# Altium schematic sheet MCH_FPGA_Banks_224_225_226_227_228.SchDoc: Metlino
size 420 x 297 mm; CheckedBy: P.Kulik,T.Przywozki,W.Ruclo; Author: G.Kasprowicz; CompanyName: WUT ISE; DrawnBy: G.Kasprowicz; Organization: WUT ISE; Address1: PW ISE; Address2: Nowowiejska 15/19 00-665 Warsaw; Address3: gkasprow@gmail.com; DocumentNumber: 8; Revision: 2; SheetNumber: 8; SheetTotal: 29; ModifiedBy: -; CheckedDate: -; Title2: FPGA banks - GTH; DivGrp: WUT ISE; Designer: G.Kasprowicz; ModifiedDate: -; ProjectName: Sensor Box
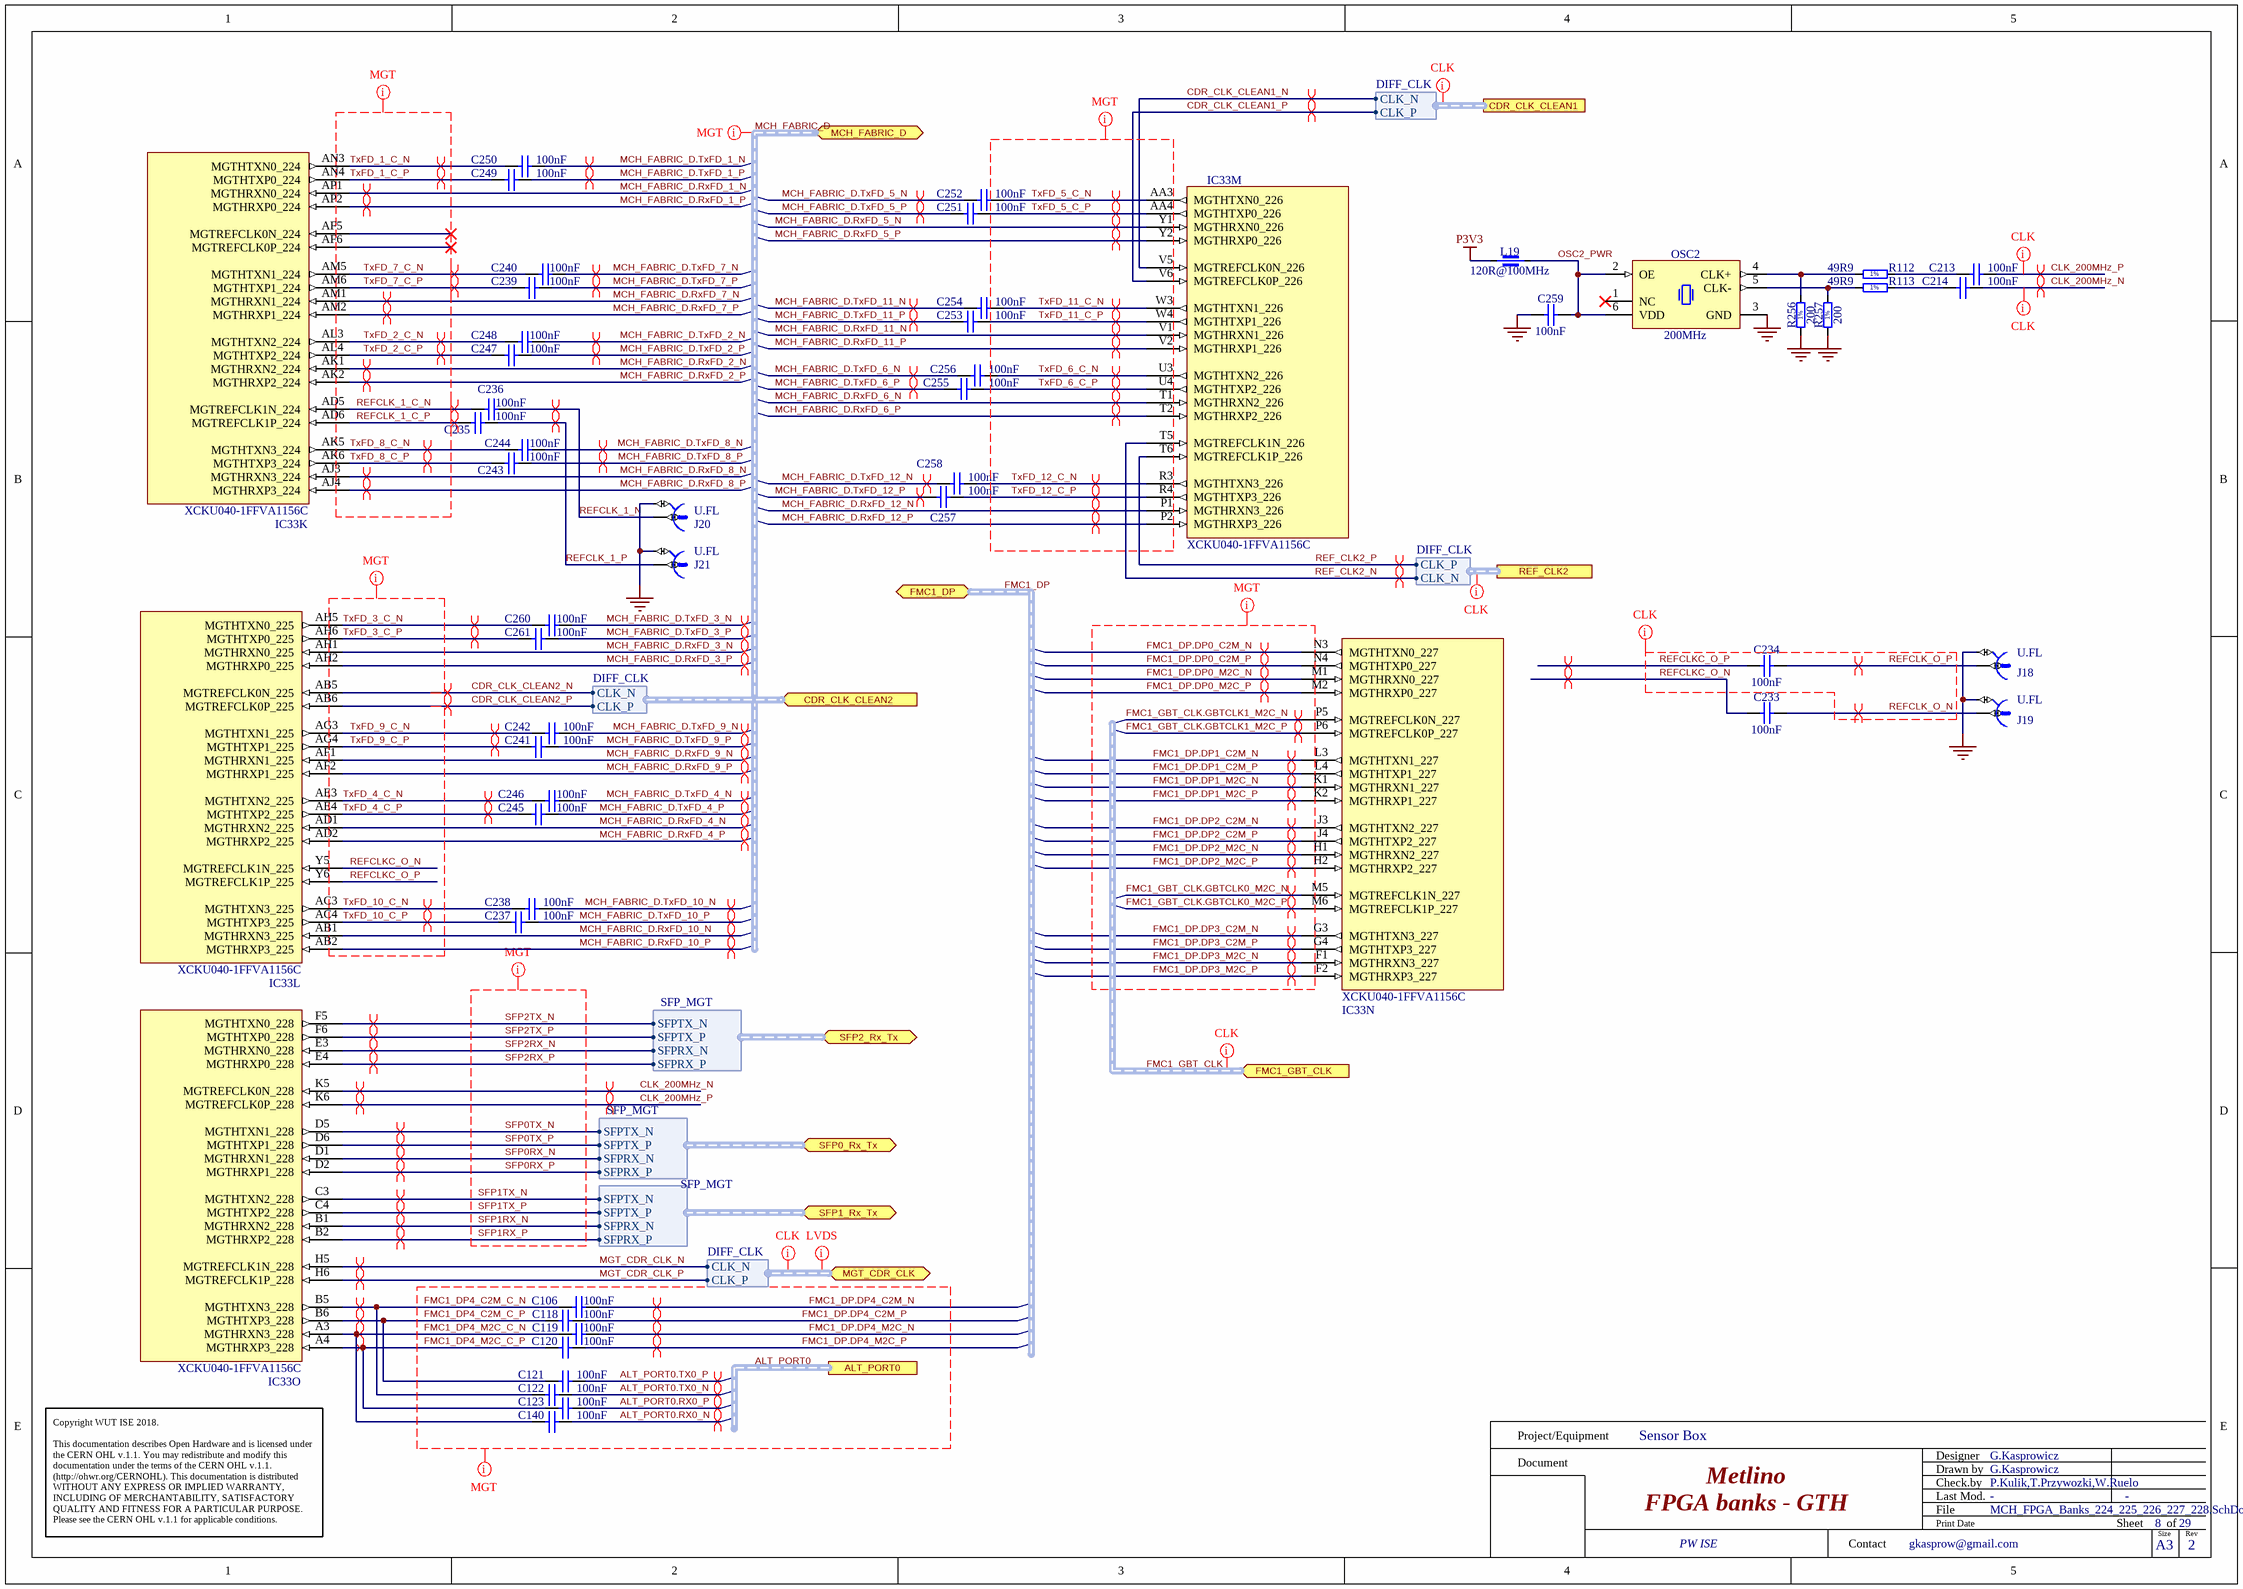
[diagram p0: MCH_FPGA_Banks_224_225_226_227_228.SchDoc]

## Parts
C106  100nF  [CAPC0603X33N]
C118  100nF  [CAPC0603X33N]
C119  100nF  [CAPC0603X33N]
C120  100nF  [CAPC0603X33N]
C121  100nF  [CAPC0603X33N]
C122  100nF  [CAPC0603X33N]
C123  100nF  [CAPC0603X33N]
C140  100nF  [CAPC0603X33N]
C213  100nF  [CAPC0603X33N]
C214  100nF  [CAPC0603X33N]
C233  100nF  [CAPC0603X33N]
C234  100nF  [CAPC0603X33N]
C235  100nF  [CAPC0603X33N]
C236  100nF  [CAPC0603X33N]
C237  100nF  [CAPC0603X33N]
C238  100nF  [CAPC0603X33N]
C239  100nF  [CAPC0603X33N]
C240  100nF  [CAPC0603X33N]
C241  100nF  [CAPC0603X33N]
C242  100nF  [CAPC0603X33N]
C243  100nF  [CAPC0603X33N]
C244  100nF  [CAPC0603X33N]
C245  100nF  [CAPC0603X33N]
C246  100nF  [CAPC0603X33N]
C247  100nF  [CAPC0603X33N]
C248  100nF  [CAPC0603X33N]
C249  100nF  [CAPC0603X33N]
C250  100nF  [CAPC0603X33N]
C251  100nF  [CAPC0603X33N]
C252  100nF  [CAPC0603X33N]
C253  100nF  [CAPC0603X33N]
C254  100nF  [CAPC0603X33N]
C255  100nF  [CAPC0603X33N]
C256  100nF  [CAPC0603X33N]
C257  100nF  [CAPC0603X33N]
C258  100nF  [CAPC0603X33N]
C259  100nF  [CAPC0603X33N]
C260  100nF  [CAPC0603X33N]
C261  100nF  [CAPC0603X33N]
IC33  XCKU040-1FFVA1156C  [BGA1156C100P34X34_3500X3500X350]  (parts K,L,M,N,O of 22)
J18  U.FL  [HIROSE_U.FL-R-SMT-1(10)]
J19  U.FL  [HIROSE_U.FL-R-SMT-1(10)]
J20  U.FL  [HIROSE_U.FL-R-SMT-1(10)]
J21  U.FL  [HIROSE_U.FL-R-SMT-1(10)]
L19  120R@100MHz  [INDC1005X55N]
OSC2  200MHz  [OSC_SILICON-LAB_SI510-6N(5X7)]
R112  49R9  [RESC1005X40N]
R113  49R9  [RESC1005X40N]
R256  200  [RESC1005X40N]
R257  200  [RESC1005X40N]

## Ports
ALT_PORT0 (harness MGTx1), CDR_CLK_CLEAN1 (harness DIFF_CLK), CDR_CLK_CLEAN2 (in, harness DIFF_CLK), FMC1_DP (bidir, harness FMC_DP), FMC1_GBT_CLK (in, harness FMC_GBT_CLK), MCH_FABRIC_D (bidir, harness MCH_FABRIC_D), MGT_CDR_CLK (bidir, harness DIFF_CLK), REF_CLK2 (harness DIFF_CLK), SFP0_Rx_Tx (bidir, harness SFP_MGT), SFP1_Rx_Tx (bidir, harness SFP_MGT), SFP2_Rx_Tx (bidir, harness SFP_MGT)

## Harnesses
DIFF_CLK: CLK_N, CLK_P
SFP_MGT: SFPRX_P, SFPRX_N, SFPTX_P, SFPTX_N

## Nets
GND: C259.1 J18.2 J19.2 J20.2 J21.2 OSC2.3(GND) R256.1 R257.1
P3V3: L19.1
ALT_PORT0.RX0_N: C140.2
ALT_PORT0.RX0_P: C123.2
ALT_PORT0.TX0_N: C122.2
ALT_PORT0.TX0_P: C121.2
CDR_CLK_CLEAN1_N: IC33.V5(MGTREFCLK0N_226) ; port CDR_CLK_CLEAN1.CLK_N
CDR_CLK_CLEAN1_P: IC33.V6(MGTREFCLK0P_226) ; port CDR_CLK_CLEAN1.CLK_P
CDR_CLK_CLEAN2_N: IC33.AB5(MGTREFCLK0N_225) ; port CDR_CLK_CLEAN2.CLK_N
CDR_CLK_CLEAN2_P: IC33.AB6(MGTREFCLK0P_225) ; port CDR_CLK_CLEAN2.CLK_P
CLK_200MHz_N: C214.2 IC33.K5(MGTREFCLK0N_228)
CLK_200MHz_P: C213.2 IC33.K6(MGTREFCLK0P_228)
FMC1_DP4_C2M_C_N: C106.1 C122.1 IC33.B5(MGTHTXN3_228)
FMC1_DP4_C2M_C_P: C118.1 C121.1 IC33.B6(MGTHTXP3_228)
FMC1_DP4_M2C_C_N: C119.1 C140.1 IC33.A3(MGTHRXN3_228)
FMC1_DP4_M2C_C_P: C120.1 C123.1 IC33.A4(MGTHRXP3_228)
FMC1_DP.DP0_C2M_N: IC33.N3(MGTHTXN0_227)
FMC1_DP.DP0_C2M_P: IC33.N4(MGTHTXP0_227)
FMC1_DP.DP0_M2C_N: IC33.M1(MGTHRXN0_227)
FMC1_DP.DP0_M2C_P: IC33.M2(MGTHRXP0_227)
FMC1_DP.DP1_C2M_N: IC33.L3(MGTHTXN1_227)
FMC1_DP.DP1_C2M_P: IC33.L4(MGTHTXP1_227)
FMC1_DP.DP1_M2C_N: IC33.K1(MGTHRXN1_227)
FMC1_DP.DP1_M2C_P: IC33.K2(MGTHRXP1_227)
FMC1_DP.DP2_C2M_N: IC33.J3(MGTHTXN2_227)
FMC1_DP.DP2_C2M_P: IC33.J4(MGTHTXP2_227)
FMC1_DP.DP2_M2C_N: IC33.H1(MGTHRXN2_227)
FMC1_DP.DP2_M2C_P: IC33.H2(MGTHRXP2_227)
FMC1_DP.DP3_C2M_N: IC33.G3(MGTHTXN3_227)
FMC1_DP.DP3_C2M_P: IC33.G4(MGTHTXP3_227)
FMC1_DP.DP3_M2C_N: IC33.F1(MGTHRXN3_227)
FMC1_DP.DP3_M2C_P: IC33.F2(MGTHRXP3_227)
FMC1_DP.DP4_C2M_N: C106.2
FMC1_DP.DP4_C2M_P: C118.2
FMC1_DP.DP4_M2C_N: C119.2
FMC1_DP.DP4_M2C_P: C120.2
FMC1_GBT_CLK.GBTCLK0_M2C_N: IC33.M5(MGTREFCLK1N_227)
FMC1_GBT_CLK.GBTCLK0_M2C_P: IC33.M6(MGTREFCLK1P_227)
FMC1_GBT_CLK.GBTCLK1_M2C_N: IC33.P5(MGTREFCLK0N_227)
FMC1_GBT_CLK.GBTCLK1_M2C_P: IC33.P6(MGTREFCLK0P_227)
MCH_FABRIC_D.RxFD_1_N: IC33.AP1(MGTHRXN0_224)
MCH_FABRIC_D.RxFD_1_P: IC33.AP2(MGTHRXP0_224)
MCH_FABRIC_D.RxFD_2_N: IC33.AK1(MGTHRXN2_224)
MCH_FABRIC_D.RxFD_2_P: IC33.AK2(MGTHRXP2_224)
MCH_FABRIC_D.RxFD_3_N: IC33.AH1(MGTHRXN0_225)
MCH_FABRIC_D.RxFD_3_P: IC33.AH2(MGTHRXP0_225)
MCH_FABRIC_D.RxFD_4_N: IC33.AD1(MGTHRXN2_225)
MCH_FABRIC_D.RxFD_4_P: IC33.AD2(MGTHRXP2_225)
MCH_FABRIC_D.RxFD_5_N: IC33.Y1(MGTHRXN0_226)
MCH_FABRIC_D.RxFD_5_P: IC33.Y2(MGTHRXP0_226)
MCH_FABRIC_D.RxFD_6_N: IC33.T1(MGTHRXN2_226)
MCH_FABRIC_D.RxFD_6_P: IC33.T2(MGTHRXP2_226)
MCH_FABRIC_D.RxFD_7_N: IC33.AM1(MGTHRXN1_224)
MCH_FABRIC_D.RxFD_7_P: IC33.AM2(MGTHRXP1_224)
MCH_FABRIC_D.RxFD_8_N: IC33.AJ3(MGTHRXN3_224)
MCH_FABRIC_D.RxFD_8_P: IC33.AJ4(MGTHRXP3_224)
MCH_FABRIC_D.RxFD_9_N: IC33.AF1(MGTHRXN1_225)
MCH_FABRIC_D.RxFD_9_P: IC33.AF2(MGTHRXP1_225)
MCH_FABRIC_D.RxFD_10_N: IC33.AB1(MGTHRXN3_225)
MCH_FABRIC_D.RxFD_10_P: IC33.AB2(MGTHRXP3_225)
MCH_FABRIC_D.RxFD_11_N: IC33.V1(MGTHRXN1_226)
MCH_FABRIC_D.RxFD_11_P: IC33.V2(MGTHRXP1_226)
MCH_FABRIC_D.RxFD_12_N: IC33.P1(MGTHRXN3_226)
MCH_FABRIC_D.RxFD_12_P: IC33.P2(MGTHRXP3_226)
MCH_FABRIC_D.TxFD_1_N: C250.2
MCH_FABRIC_D.TxFD_1_P: C249.2
MCH_FABRIC_D.TxFD_2_N: C248.2
MCH_FABRIC_D.TxFD_2_P: C247.2
MCH_FABRIC_D.TxFD_3_N: C260.2
MCH_FABRIC_D.TxFD_3_P: C261.2
MCH_FABRIC_D.TxFD_4_N: C246.2
MCH_FABRIC_D.TxFD_4_P: C245.2
MCH_FABRIC_D.TxFD_5_N: C252.1
MCH_FABRIC_D.TxFD_5_P: C251.1
MCH_FABRIC_D.TxFD_6_N: C256.1
MCH_FABRIC_D.TxFD_6_P: C255.1
MCH_FABRIC_D.TxFD_7_N: C240.2
MCH_FABRIC_D.TxFD_7_P: C239.2
MCH_FABRIC_D.TxFD_8_N: C244.2
MCH_FABRIC_D.TxFD_8_P: C243.2
MCH_FABRIC_D.TxFD_9_N: C242.2
MCH_FABRIC_D.TxFD_9_P: C241.2
MCH_FABRIC_D.TxFD_10_N: C238.2
MCH_FABRIC_D.TxFD_10_P: C237.2
MCH_FABRIC_D.TxFD_11_N: C254.1
MCH_FABRIC_D.TxFD_11_P: C253.1
MCH_FABRIC_D.TxFD_12_N: C258.1
MCH_FABRIC_D.TxFD_12_P: C257.1
MGT_CDR_CLK_N: IC33.H5(MGTREFCLK1N_228) ; port MGT_CDR_CLK.CLK_N
MGT_CDR_CLK_P: IC33.H6(MGTREFCLK1P_228) ; port MGT_CDR_CLK.CLK_P
OSC2_PWR: C259.2 L19.2 OSC2.2(OE) OSC2.6(VDD)
REF_CLK2_N: IC33.T5(MGTREFCLK1N_226) ; port REF_CLK2.CLK_N
REF_CLK2_P: IC33.T6(MGTREFCLK1P_226) ; port REF_CLK2.CLK_P
REFCLK_1_C_N: C236.1 IC33.AD5(MGTREFCLK1N_224)
REFCLK_1_C_P: C235.1 IC33.AD6(MGTREFCLK1P_224)
REFCLK_1_N: C236.2 J20.1
REFCLK_1_P: C235.2 J21.1
REFCLK_O_N: C233.2 J19.1
REFCLK_O_P: C234.2 J18.1
REFCLKC_O_N: C233.1 IC33.Y5(MGTREFCLK1N_225)
REFCLKC_O_P: C234.1 IC33.Y6(MGTREFCLK1P_225)
SFP0RX_N: IC33.D1(MGTHRXN1_228) ; port SFP0_Rx_Tx.SFPRX_N
SFP0RX_P: IC33.D2(MGTHRXP1_228) ; port SFP0_Rx_Tx.SFPRX_P
SFP0TX_N: IC33.D5(MGTHTXN1_228) ; port SFP0_Rx_Tx.SFPTX_N
SFP0TX_P: IC33.D6(MGTHTXP1_228) ; port SFP0_Rx_Tx.SFPTX_P
SFP1RX_N: IC33.B1(MGTHRXN2_228) ; port SFP1_Rx_Tx.SFPRX_N
SFP1RX_P: IC33.B2(MGTHRXP2_228) ; port SFP1_Rx_Tx.SFPRX_P
SFP1TX_N: IC33.C3(MGTHTXN2_228) ; port SFP1_Rx_Tx.SFPTX_N
SFP1TX_P: IC33.C4(MGTHTXP2_228) ; port SFP1_Rx_Tx.SFPTX_P
SFP2RX_N: IC33.E3(MGTHRXN0_228) ; port SFP2_Rx_Tx.SFPRX_N
SFP2RX_P: IC33.E4(MGTHRXP0_228) ; port SFP2_Rx_Tx.SFPRX_P
SFP2TX_N: IC33.F5(MGTHTXN0_228) ; port SFP2_Rx_Tx.SFPTX_N
SFP2TX_P: IC33.F6(MGTHTXP0_228) ; port SFP2_Rx_Tx.SFPTX_P
TxFD_1_C_N: C250.1 IC33.AN3(MGTHTXN0_224)
TxFD_1_C_P: C249.1 IC33.AN4(MGTHTXP0_224)
TxFD_2_C_N: C248.1 IC33.AL3(MGTHTXN2_224)
TxFD_2_C_P: C247.1 IC33.AL4(MGTHTXP2_224)
TxFD_3_C_N: C260.1 IC33.AH5(MGTHTXN0_225)
TxFD_3_C_P: C261.1 IC33.AH6(MGTHTXP0_225)
TxFD_4_C_N: C246.1 IC33.AE3(MGTHTXN2_225)
TxFD_4_C_P: C245.1 IC33.AE4(MGTHTXP2_225)
TxFD_5_C_N: C252.2 IC33.AA3(MGTHTXN0_226)
TxFD_5_C_P: C251.2 IC33.AA4(MGTHTXP0_226)
TxFD_6_C_N: C256.2 IC33.U3(MGTHTXN2_226)
TxFD_6_C_P: C255.2 IC33.U4(MGTHTXP2_226)
TxFD_7_C_N: C240.1 IC33.AM5(MGTHTXN1_224)
TxFD_7_C_P: C239.1 IC33.AM6(MGTHTXP1_224)
TxFD_8_C_N: C244.1 IC33.AK5(MGTHTXN3_224)
TxFD_8_C_P: C243.1 IC33.AK6(MGTHTXP3_224)
TxFD_9_C_N: C242.1 IC33.AG3(MGTHTXN1_225)
TxFD_9_C_P: C241.1 IC33.AG4(MGTHTXP1_225)
TxFD_10_C_N: C238.1 IC33.AC3(MGTHTXN3_225)
TxFD_10_C_P: C237.1 IC33.AC4(MGTHTXP3_225)
TxFD_11_C_N: C254.2 IC33.W3(MGTHTXN1_226)
TxFD_11_C_P: C253.2 IC33.W4(MGTHTXP1_226)
TxFD_12_C_N: C258.2 IC33.R3(MGTHTXN3_226)
TxFD_12_C_P: C257.2 IC33.R4(MGTHTXP3_226)
NetC213_1: C213.1 R112.2
NetC214_1: C214.1 R113.2
NetOSC2_4: OSC2.4(CLK+) R112.1 R256.2
NetOSC2_5: OSC2.5(CLK-) R113.1 R257.2

Not connected (* = marked no-connect by the designer): IC33 AF5(MGTREFCLK0N_224)* AF6(MGTREFCLK0P_224)*; OSC2 1(NC)*

## Buses and harness runs
harness ALT_PORT0 = port ALT_PORT0
harness FMC1_DP = port FMC1_DP
harness FMC1_GBT_CLK = port FMC1_GBT_CLK
harness MCH_FABRIC_D = port MCH_FABRIC_D

## Layout directives
differential pair: ALT_PORT0.RX0_N, ALT_PORT0.RX0_P, ALT_PORT0.TX0_N, ALT_PORT0.TX0_P, CDR_CLK_CLEAN1_N, CDR_CLK_CLEAN1_P, CDR_CLK_CLEAN2_N, CDR_CLK_CLEAN2_P, CLK_200MHz_N, CLK_200MHz_P, FMC1_DP4_C2M_C_N, FMC1_DP4_C2M_C_P, FMC1_DP4_M2C_C_N, FMC1_DP4_M2C_C_P, FMC1_DP.DP0_C2M_N, FMC1_DP.DP0_C2M_P, FMC1_DP.DP0_M2C_N, FMC1_DP.DP0_M2C_P, FMC1_DP.DP1_C2M_N, FMC1_DP.DP1_C2M_P, FMC1_DP.DP1_M2C_N, FMC1_DP.DP1_M2C_P, FMC1_DP.DP2_C2M_N, FMC1_DP.DP2_C2M_P, FMC1_DP.DP2_M2C_N, FMC1_DP.DP2_M2C_P, FMC1_DP.DP3_C2M_N, FMC1_DP.DP3_C2M_P, FMC1_DP.DP3_M2C_N, FMC1_DP.DP3_M2C_P, FMC1_DP.DP4_C2M_N, FMC1_DP.DP4_C2M_P, FMC1_DP.DP4_M2C_N, FMC1_DP.DP4_M2C_P, FMC1_GBT_CLK.GBTCLK0_M2C_N, FMC1_GBT_CLK.GBTCLK0_M2C_P, FMC1_GBT_CLK.GBTCLK1_M2C_N, FMC1_GBT_CLK.GBTCLK1_M2C_P, MCH_FABRIC_D.RxFD_1_N, MCH_FABRIC_D.RxFD_1_P, MCH_FABRIC_D.RxFD_2_N, MCH_FABRIC_D.RxFD_2_P, MCH_FABRIC_D.RxFD_3_N, MCH_FABRIC_D.RxFD_3_P, MCH_FABRIC_D.RxFD_4_N, MCH_FABRIC_D.RxFD_4_P, MCH_FABRIC_D.RxFD_5_N, MCH_FABRIC_D.RxFD_5_P, MCH_FABRIC_D.RxFD_6_N, MCH_FABRIC_D.RxFD_6_P, MCH_FABRIC_D.RxFD_7_N, MCH_FABRIC_D.RxFD_7_P, MCH_FABRIC_D.RxFD_8_N, MCH_FABRIC_D.RxFD_8_P, MCH_FABRIC_D.RxFD_9_N, MCH_FABRIC_D.RxFD_9_P, MCH_FABRIC_D.RxFD_10_N, MCH_FABRIC_D.RxFD_10_P, MCH_FABRIC_D.RxFD_11_N, MCH_FABRIC_D.RxFD_11_P, MCH_FABRIC_D.RxFD_12_N, MCH_FABRIC_D.RxFD_12_P, MCH_FABRIC_D.TxFD_1_N, MCH_FABRIC_D.TxFD_1_P, MCH_FABRIC_D.TxFD_2_N, MCH_FABRIC_D.TxFD_2_P, MCH_FABRIC_D.TxFD_3_N, MCH_FABRIC_D.TxFD_3_P, MCH_FABRIC_D.TxFD_4_N, MCH_FABRIC_D.TxFD_4_P, MCH_FABRIC_D.TxFD_5_N, MCH_FABRIC_D.TxFD_5_P, MCH_FABRIC_D.TxFD_6_N, MCH_FABRIC_D.TxFD_6_P, MCH_FABRIC_D.TxFD_7_N, MCH_FABRIC_D.TxFD_7_P, MCH_FABRIC_D.TxFD_8_N, MCH_FABRIC_D.TxFD_8_P, MCH_FABRIC_D.TxFD_9_N, MCH_FABRIC_D.TxFD_9_P, MCH_FABRIC_D.TxFD_10_N, MCH_FABRIC_D.TxFD_10_P, MCH_FABRIC_D.TxFD_11_N, MCH_FABRIC_D.TxFD_11_P, MCH_FABRIC_D.TxFD_12_N, MCH_FABRIC_D.TxFD_12_P, MGT_CDR_CLK_N, MGT_CDR_CLK_P, REF_CLK2_N, REF_CLK2_P, REFCLK_1_C_N, REFCLK_1_C_P, REFCLK_1_N, REFCLK_1_P, REFCLK_O_N, REFCLK_O_P, REFCLKC_O_N, REFCLKC_O_P, SFP0RX_N, SFP0RX_P, SFP0TX_N, SFP0TX_P, SFP1RX_N, SFP1RX_P, SFP1TX_N, SFP1TX_P, SFP2RX_N, SFP2RX_P, SFP2TX_N, SFP2TX_P, TxFD_1_C_N, TxFD_1_C_P, TxFD_2_C_N, TxFD_2_C_P, TxFD_3_C_N, TxFD_3_C_P, TxFD_4_C_N, TxFD_4_C_P, TxFD_5_C_N, TxFD_5_C_P, TxFD_6_C_N, TxFD_6_C_P, TxFD_7_C_N, TxFD_7_C_P, TxFD_8_C_N, TxFD_8_C_P, TxFD_9_C_N, TxFD_9_C_P, TxFD_10_C_N, TxFD_10_C_P, TxFD_11_C_N, TxFD_11_C_P, TxFD_12_C_N, TxFD_12_C_P
net class MGT: (no net found under the mark), ALT_PORT0, ALT_PORT0.RX0_N, ALT_PORT0.RX0_P, ALT_PORT0.TX0_N, ALT_PORT0.TX0_P, FMC1_DP4_C2M_C_N, FMC1_DP4_C2M_C_P, FMC1_DP4_M2C_C_N, FMC1_DP4_M2C_C_P, FMC1_DP.DP0_C2M_N, FMC1_DP.DP0_C2M_P, FMC1_DP.DP0_M2C_N, FMC1_DP.DP0_M2C_P, FMC1_DP.DP1_C2M_N, FMC1_DP.DP1_C2M_P, FMC1_DP.DP1_M2C_N, FMC1_DP.DP1_M2C_P, FMC1_DP.DP2_C2M_N, FMC1_DP.DP2_C2M_P, FMC1_DP.DP2_M2C_N, FMC1_DP.DP2_M2C_P, FMC1_DP.DP3_C2M_N, FMC1_DP.DP3_C2M_P, FMC1_DP.DP3_M2C_N, FMC1_DP.DP3_M2C_P, FMC1_DP.DP4_C2M_N, FMC1_DP.DP4_C2M_P, FMC1_DP.DP4_M2C_N, FMC1_DP.DP4_M2C_P, FMC1_GBT_CLK.GBTCLK0_M2C_N, FMC1_GBT_CLK.GBTCLK0_M2C_P, FMC1_GBT_CLK.GBTCLK1_M2C_N, FMC1_GBT_CLK.GBTCLK1_M2C_P, REFCLK_1_C_N, REFCLK_1_C_P, REFCLKC_O_N, REFCLKC_O_P, SFP0RX_N, SFP0RX_P, SFP0TX_N, SFP0TX_P, SFP1RX_N, SFP1RX_P, SFP1TX_N, SFP1TX_P, SFP2RX_N, SFP2RX_P, SFP2TX_N, SFP2TX_P, TxFD_1_C_N, TxFD_1_C_P, TxFD_2_C_N, TxFD_2_C_P, TxFD_3_C_N, TxFD_3_C_P, TxFD_4_C_N, TxFD_4_C_P, TxFD_5_C_N, TxFD_5_C_P, TxFD_6_C_N, TxFD_6_C_P, TxFD_7_C_N, TxFD_7_C_P, TxFD_8_C_N, TxFD_8_C_P, TxFD_9_C_N, TxFD_9_C_P, TxFD_10_C_N, TxFD_10_C_P, TxFD_11_C_N, TxFD_11_C_P, TxFD_12_C_N, TxFD_12_C_P
net class CLK: (no net found under the mark), CLK_200MHz_N, CLK_200MHz_P, REFCLK_O_N, REFCLK_O_P, REFCLKC_O_N, REFCLKC_O_P
net class LVDS: (no net found under the mark)

## Notes on the sheet
- Project/Equipment
- Document
- Designer
- Drawn by
- Check.by
- Copyright WUT ISE 2018.
  This documentation describes Open Hardware and is licensed under the CERN OHL v.1.1. You may redistribute and modify this documentation under the terms of the CERN OHL v.1.1. (http://ohwr.org/CERNOHL). This documentation is distributed WITHOUT ANY EXPRESS OR IMPLIED WARRANTY, INCLUDING OF MERCHANTABILITY, SATISFACTORY QUALITY AND FITNESS FOR A PARTICULAR PURPOSE. Please see the CERN OHL v.1.1 for applicable conditions.
- Contact
- File
- Last Mod.
- Print Date
- Sheet
- Size
- A3
- of
- Rev
- (in symbol R0402_49R9_1%_0.0625W_100PPM) 1%
- (in symbol R0402_200R_1%_0.0625W_100PPM) 1%

## Library data of the parts
C106 C118-C123 C140 C213 C214 C233-C261 = CC0201_100NF_6.3V_10%_X5R: Non-polarised capacitor; Manufacturer: GENERIC; Part Description: SMD Multilayer Chip Ceramic Capacitor; Manufacturer1 Part Number: 02016D104KAT2A; Tolerance: ±10%; Voltage: 6.3V; TC: X5R; Manufacturer Part Number: CC0201_100NF_6.3V_10%_X5R; Part Number: CC0201_100NF_6.3V_10%_X5R; Value: 100nF; Component Kind: Standard; Component Type: Standard; Pin Count: 2; Status: Not Recommended; Case: 0201; Mounted: Yes; Socket: No; SMD: Yes; Sense: No; Manufacturer1 Example: AVX; Manufacturer1 ComponentHeight: 0.33mm; HelpURL: \\cern.ch\dfs\Applications\Altium\Datasheets\CC0201_X5R_AVX.pdf; Author: CERN DEM JLC; CreateDate: 03.12.2007; LatestRevisionDate: 03.12.2007
IC33 = XCKU040-1FFVA1156C: Kintex UltraScale FPGA, 520 I/O, 530K Cells, 1156-Ball BGA, Speed Grade 1, Commercial Grade; Manufacturer: XILINX; Part Description: Kintex UltraScale, 40 DLL I/O, 416 HP I/O, 104 HR I/O, 1156-Pin BGA, Speed Grade 1, Commercial Grade; PressFit: No; Bonding: No; PackageDescription: BGA, 1.00mm Pitch, Square; 1156 Pin, 34 Columns X 34 Rows, Body 35.00mm X 35.00mm X 3.50mm H, IPC Medium Density; Part Number: XCKU040-1FFVA1156C; Component Kind: Standard; Component Type: Standard; Device: XCKU040-1FFVA1156C; Manufacturer Part Number: XCKU040-1FFVA1156C; Pin Count: 1156; Case: BGA1156; Mounted: Yes; Socket: No; SMD: Yes; Sense: No; ComponentHeight: 3.5mm; HelpURL: \\cern.ch\dfs\Applications\Altium\Datasheets\XCKU040-1FFVA1156C.pdf; ComponentLink1URL: \\cern.ch\dfs\Applications\Altium\Datasheets\XCKU040-1FFVA1156C_Package-Pinout.pdf; ComponentLink1Description: Package/Pinout; Author: CERN DEM CA; CreateDate: 16.08.2016; LatestRevisionDate: 16.08.2016
J18-J21 = HIROSE_U.FL-R-SMT-1(10): Manufacturer: HIROSE (HRS); Part Description: Up to 6GHz Ultra Small Surface Mount Male Coaxial Connectors U.FL Series; PressFit: No; Manufacturer Part Number: U.FL-R-SMT-1(10); Part Number: HIROSE_U.FL-R-SMT-1(10); Component Kind: Standard; Component Type: Standard; Pin Count: 2; Family: U.FL; Mounted: Yes; Socket: No; SMD: Yes; Sense: No; Status: None; ComponentHeight: 1.25mm; HelpURL: \\cern.ch\dfs\Applications\Altium\Datasheets\HIROSE_U.FL-R-SMT-1(10).pdf; Author: CERN DEM JLC; CreateDate: 24.03.2010; LatestRevisionDate: 24.03.2010
L19 = IND0402_MURATA_BLM15PX121SN1D: Manufacturer: MURATA; Part Description: SMD EMIFIL Chip Ferrite Bead; Tolerance: ±25%; Power: 2A; Resistance: 0.055R; Manufacturer Part Number: BLM15PX121SN1D; Part Number: IND0402_MURATA_BLM15PX121SN1D; Value: 120R@100MHz; Component Kind: Standard; Component Type: Standard; Pin Count: 2; Status: None; Case: 0402; Mounted: Yes; Socket: No; SMD: Yes; Sense: No; ComponentHeight: 0.55mm; HelpURL: \\cern.ch\dfs\Applications\Altium\Datasheets\IND0402_MURATA_BLM15PX.pdf; Author: CERN DEM JMW; CreateDate: 19.02.2014; LatestRevisionDate: 25.10.2018
OSC2 = OSC_200MHZ_SILICON-LAB_510ABA200M000AAG: Crystal Oscillator 6 pins, Si510 (LVDS/LVPECL/HCSL/Dual CMOS); Manufacturer: SILICON LABS; Part Description: crystal oscillator, 200MHz, 100ppm, 3.3V, LVDS, 5x7mm; PressFit: No; Bonding: No; Manufacturer Part Number: 510ABA200M000AAG; PackageDescription: Oscillator Si510 Series, 6 pins, 5x7mm; Part Number: OSC_200MHZ_SILICON-LAB_510ABA200M000AAG; Value: 200MHz; Component Kind: Standard; Component Type: Standard; Pin Count: 6; Mounted: Yes; Socket: No; SMD: Yes; Sense: No; ComponentHeight: 1.8mm; HelpURL: \\cern.ch\dfs\Applications\Altium\Datasheets\OSC_SILICON-LAB_SI510.pdf; Author: GK; CreateDate: 10.08.2015; LatestRevisionDate: 26.11.2018
R112 R113 = R0402_49R9_1%_0.0625W_100PPM: Resistor - 1%; Part Description: General Purpose Thick Film Chip Resistor; Manufacturer: GENERIC; Manufacturer1 Part Number: 232270674999L or RC0402FR-0749R9L; TC: ±100ppm/°C; PressFit: No; Part Number: R0402_49R9_1%_0.0625W_100PPM; Component Kind: Standard; Component Type: Standard; Pin Count: 2; Value: 49R9; Status: Not Recommended; Power: 0.0625W; Tolerance: ±1%; Manufacturer Part Number: R0402_49R9_1%_0.0625W_100PPM; Case: 0402; Mounted: Yes; Sense: No; Socket: No; SMD: Yes; Manufacturer1 Example: YAGEO PHYCOMP; Manufacturer1 ComponentHeight: 0.4mm; HelpURL: \\cern.ch\dfs\Applications\Altium\Datasheets\R0402_Phycomp_RC0402.pdf; Author: CERN DEM JLC; CreateDate: 24.10.2012; LatestRevisionDate: 24.10.2012
R256 R257 = R0402_200R_1%_0.0625W_100PPM: Resistor - 1%; Manufacturer: GENERIC; Part Description: General Purpose Thick Film Chip Resistor; Manufacturer1 Part Number: 232270672001L; TC: ±100ppm/°C; PressFit: No; Manufacturer Part Number: R0402_200R_1%_0.0625W_100PPM; Part Number: R0402_200R_1%_0.0625W_100PPM; Tolerance: ±1%; Value: 200; Component Kind: Standard; Component Type: Standard; Pin Count: 2; Status: Not Recommended; Power: 0.0625W; Case: 0402; Mounted: Yes; Sense: No; Socket: No; SMD: Yes; Manufacturer1 Example: YAGEO PHYCOMP; Manufacturer1 ComponentHeight: 0.4mm; HelpURL: \\cern.ch\dfs\Applications\Altium\Datasheets\R0402_Phycomp_RC0402.pdf; Author: CERN DEM JLC; CreateDate: 03.12.2007; LatestRevisionDate: 17.10.2012